# EAGLE schematic RiseUpTop (EAGLE 9.6.1)
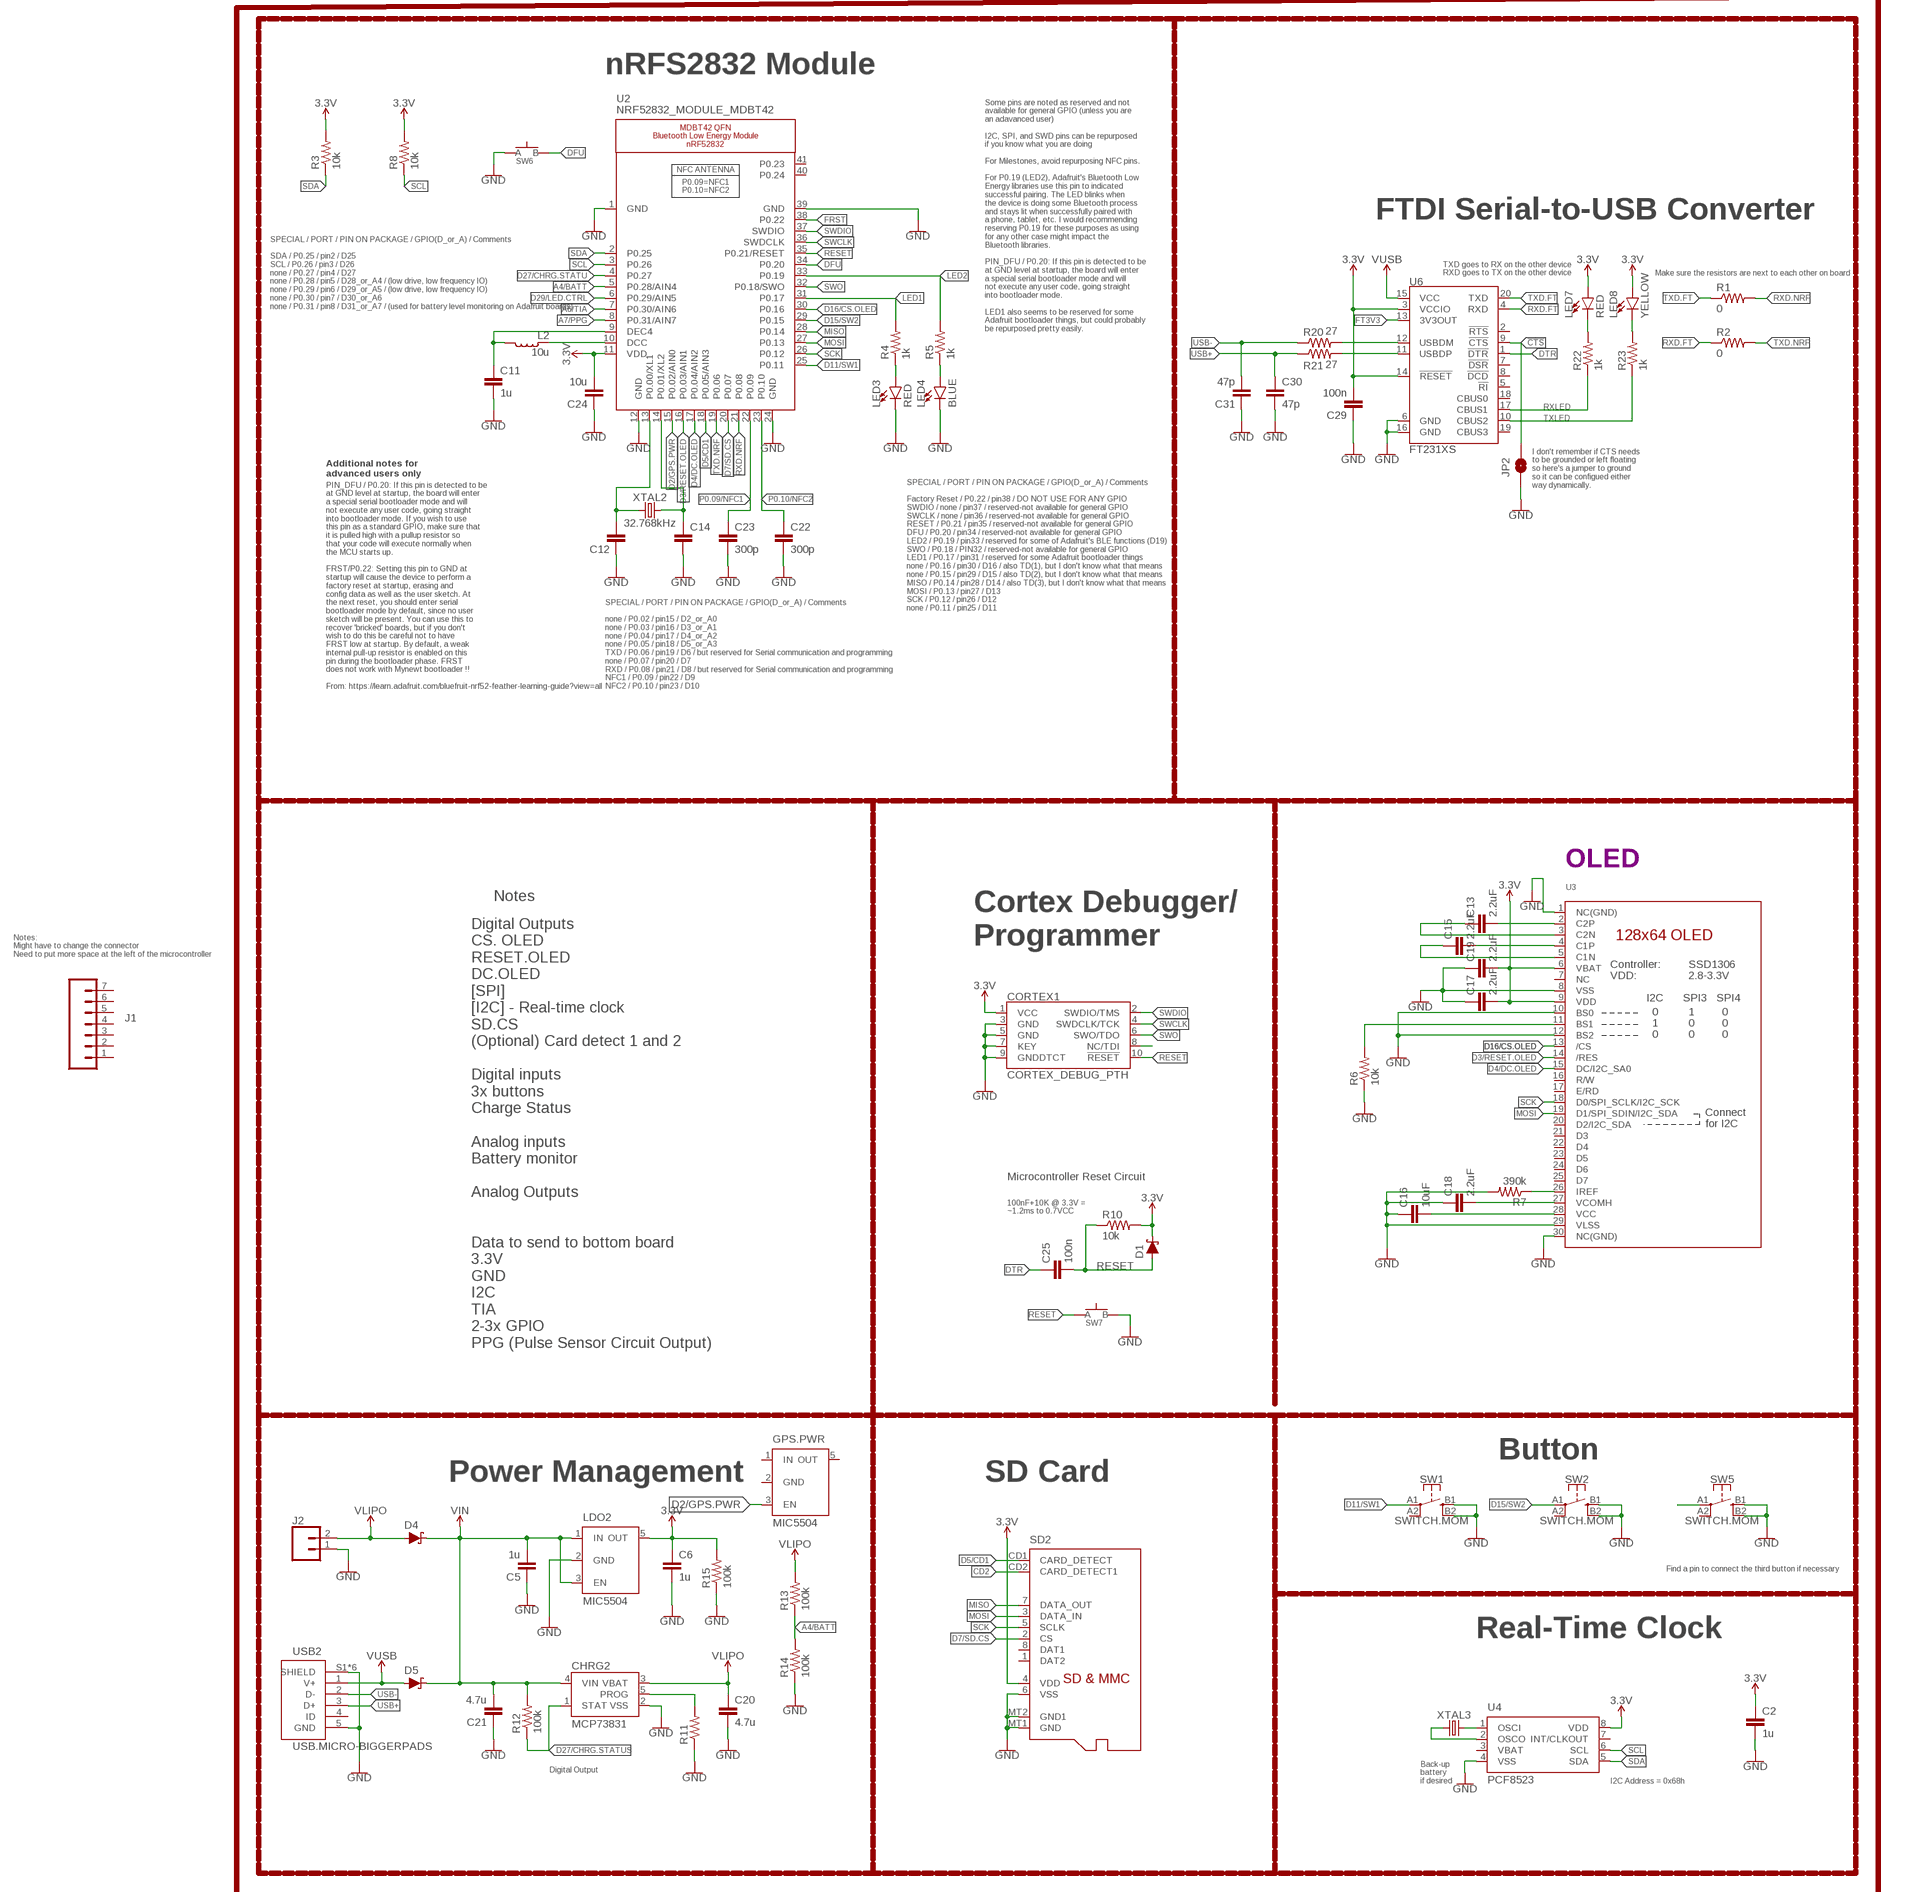
[diagram p0: schematic, sheet 1, part 1 of 2]
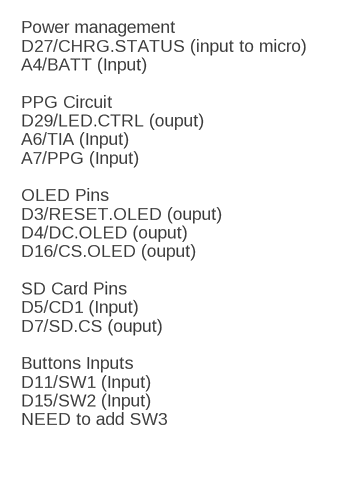
[diagram p1: schematic, sheet 1, part 2 of 2]

## Parts
C2  1u  CAPACITOR0603  [C0603]
C5  1u  CAPACITOR0603  [C0603]
C6  1u  CAPACITOR0603  [C0603]
C11  1u  CAPACITOR0603  [C0603]
C12  CAPACITOR0603  [C0603]
C13  2.2uF  CAPACITOR0402  [C0402]
C14  CAPACITOR0603  [C0603]
C15  2.2uF  CAPACITOR0402  [C0402]
C16  10uF  CAPACITOR0603  [C0603]
C17  2.2uF  CAPACITOR0402  [C0402]
C18  2.2uF  CAPACITOR0402  [C0402]
C19  2.2uF  CAPACITOR0402  [C0402]
C20  4.7u  CAPACITOR0603  [C0603]
C21  4.7u  CAPACITOR0603  [C0603]
C22  300p  CAPACITOR0603  [C0603]
C23  300p  CAPACITOR0603  [C0603]
C24  10u  CAPACITOR0805  [C0805]
C25  100n  CAPACITOR0603  [C0603]
C29  100n  CAPACITOR0603  [C0603]
C30  47p  CAPACITOR0603  [C0603]
C31  47p  CAPACITOR0603  [C0603]
CHRG2  MCP73831  [SOT23-5]
CORTEX1  CORTEX_DEBUG_PTH  [2X5-PTH-1.27MM]
D1  SCHOTTKY-USC  [USC]
D4  SCHOTTKY-USC  [USC]
D5  SCHOTTKY-USC  [USC]
GPS.PWR  MIC5504  [SOT23-5]
J1  CONN_07  [1X07]
J2  CONN_02  [1X02]
JP2  JUMPER-SMT_2_NO_SILK  [SMT-JUMPER_2_NO_SILK]
L2  10u  INDUCTOR0603  [L0603]
LDO2  MIC5504  [SOT23-5]
LED3  RED  LED0603  [LED-0603]
LED4  BLUE  LED0603  [LED-0603]
LED7  RED  LED0603  [LED-0603]
LED8  YELLOW  LED0603  [LED-0603]
R1  0  RESISTOR0603  [R0603]
R2  0  RESISTOR0603  [R0603]
R3  10k  RESISTOR0603  [R0603]
R4  1k  RESISTOR0603  [R0603]
R5  1k  RESISTOR0603  [R0603]
R6  10k  RESISTOR0603  [R0603]
R7  390k  RESISTOR0603  [R0603]
R8  10k  RESISTOR0603  [R0603]
R10  10k  RESISTOR0603  [R0603]
R11  RESISTOR0603  [R0603]
R12  100k  RESISTOR0603  [R0603]
R13  100k  RESISTOR0603  [R0603]
R14  100k  RESISTOR0603  [R0603]
R15  100k  RESISTOR0603  [R0603]
R20  27  RESISTOR0603  [R0603]
R21  27  RESISTOR0603  [R0603]
R22  1k  RESISTOR0603  [R0603]
R23  1k  RESISTOR0603  [R0603]
SD2  MICROSD  [MICROSD]
SW1  SWITCH.MOM  [TACTILE_SWITCH_SMD_6.2MM_TALL]
SW2  SWITCH.MOM  [TACTILE_SWITCH_SMD_6.2MM_TALL]
SW5  SWITCH.MOM  [TACTILE_SWITCH_SMD_6.2MM_TALL]
SW6  SPST-PTS830GG140-COPY.1-3  [BUTTON-GULLWING]
SW7  SPST-PTS830GG140-COPY.1-3  [BUTTON-GULLWING]
U2  NRF52832_MODULE_MDBT42  [BLE_MODULE_RAYTAC_MDBT42]
U3  DISP_OLED_UG-2864HSWEG01-NO-WRAPAROUND  [UG-2864HSWEG01_0.96IN_NO-WRAPAROUND]
U4  PCF8523  [SO8]
U6  FT231XS  [SSOP20_L]
USB2  USB.MICRO-BIGGERPADS  [USB-MICRO-01.BIGGERPADS]
XTAL2  32.768kHz  CRYSTALECS-.327-12.5-12-C-TR  [2-SMD.NOLEAD.2.0MMTO1.2MM]
XTAL3  32.7680kHz  CRYSTALECS-.327-12.5-12-C-TR  [2-SMD.NOLEAD.2.0MMTO1.2MM]

## Nets
3.3V: C2.1 C6.1 C17.2 C19.2 C24.2 C29.2 CORTEX1.1(VCC) D1.-(C) LDO2.5(OUT) LED7.A LED8.A R3.2 R8.2 R10.2 R15.2 SD2.4(VDD) U2.11(VDD) U3.6(VBAT) U3.9(VDD) U4.8(VDD) U6.3(VCCIO) U6.14(!RESET)
!CTS: JP2.2 U6.9(!CTS)
A4/BATT: R13.1 R14.2 U2.5(P0.28/AIN4)
A6/TIA: U2.7(P0.30/AIN6)
A7/PPG: U2.8(P0.31/AIN7)
CD2: SD2.CD2(CARD_DETECT1)
D2/GPS.PWR: GPS.PWR.3(EN) U2.15(P0.02/AIN0)
D3/RESET.OLED: U2.16(P0.03/AIN1) U3.14(/RES)
D4/DC.OLED: U2.17(P0.04/AIN2) U3.15(DC/I2C_SA0)
D5/CD1: SD2.CD1(CARD_DETECT) U2.18(P0.05/AIN3)
D7/SD.CS: SD2.2(CS) U2.20(P0.07)
D11/SW1: SW1.A1 U2.25(P0.11)
D15/SW2: SW2.A1 U2.29(P0.15)
D16/CS.OLED: U2.30(P0.16) U3.13(/CS)
D16/SW3: SW5.A1
D27/CHRG.STATU: U2.4(P0.27)
D27/CHRG.STATUS: CHRG2.1(STAT) R12.1
D29/LED.CTRL: U2.6(P0.29/AIN5)
DFU: SW6.3(B) U2.34(P0.20)
DTR: C25.1 U6.1(!DTR)
FRST: U2.38(P0.22)
FT3V3: U6.13(3V3OUT)
GND: C2.2 C5.1 C6.2 C11.2 C12.1 C14.2 C16.1 C17.1 C18.1 C19.1 C20.2 C21.1 C22.2 C23.2 C24.1 C29.1 C30.2 C31.1 CHRG2.2(VSS) CORTEX1.3(GND) CORTEX1.5(GND) CORTEX1.7(KEY) CORTEX1.9(GNDDTCT) J2.1 JP2.1 LDO2.2(GND) LED3.C LED4.C R6.1 R7.2 R11.1 R14.1 R15.1 SD2.6(VSS) SD2.MT1(GND) SD2.MT2(GND1) SW1.B1 SW1.B2 SW2.B1 SW2.B2 SW5.B1 SW5.B2 SW6.1(A) SW7.3(B) U2.1(GND) U2.12(GND) U2.24(GND) U2.39(GND) U3.1(NC(GND)) U3.8(VSS) U3.10(BS0) U3.12(BS2) U3.29(VLSS) U3.30(NC(GND)) U4.4(VSS) U6.6(GND) U6.16(GND) USB2.5(GND) USB2.S1(SHIELD) USB2.S2(SHIELD) USB2.S3(SHIELD) USB2.S4(SHIELD) USB2.S5(SHIELD) USB2.S6(SHIELD)
LED1: R4.2 U2.31(P0.17)
LED2: R5.2 U2.33(P0.19)
MISO: SD2.7(DATA_OUT) U2.28(P0.14)
MOSI: SD2.3(DATA_IN) U2.27(P0.13) U3.19(D1/SPI_SDIN/I2C_SDA)
N$1: R6.2 U3.11(BS1)
N$2: R7.1 U3.26(IREF)
N$3: C13.2 U3.2(C2P)
N$4: U4.2(OSCO) XTAL3.P$1
N$5: C13.1 U3.3(C2N)
N$6: U4.1(OSCI) XTAL3.P$2
N$7: C15.2 U3.4(C1P)
N$8: C15.1 U3.5(C1N)
N$13: C16.2 U3.28(VCC)
N$15: C18.2 U3.27(VCOMH)
N$16: C12.2 U2.13(P0.00/XL1) XTAL2.P$1
N$17: CHRG2.5(PROG) R11.2
N$18: C14.1 U2.14(P0.01/XL2) XTAL2.P$2
N$21: LED3.A R4.1
N$22: LED4.A R5.1
N$23: L2.1 U2.10(DCC)
N$24: C11.1 L2.2 U2.9(DEC4)
N$25: CORTEX1.8(NC/TDI)
N$30: R20.2 U6.12(USBDM)
N$31: R21.2 U6.11(USBDP)
N$32: LED7.C R22.2
N$33: LED8.C R23.2
P0.09/NFC1: C23.1 U2.22(P0.09)
P0.10/NFC2: C22.1 U2.23(P0.10)
RESET: C25.2 CORTEX1.10(!RESET) D1.+(A) R10.1 SW7.1(A) U2.35(P0.21/RESET)
RXD.FT: R2.1 U6.4(RXD)
RXD.NRF: R1.2 U2.21(P0.08)
RXLED: R22.1 U6.17(CBUS1)
SCK: SD2.5(SCLK) U2.26(P0.12) U3.18(D0/SPI_SCLK/I2C_SCK)
SCL: R8.1 U2.3(P0.26) U4.6(SCL)
SDA: R3.1 U2.2(P0.25) U4.5(SDA)
SWCLK: CORTEX1.4(SWDCLK/TCK) U2.36(SWDCLK)
SWDIO: CORTEX1.2(SWDIO/TMS) U2.37(SWDIO)
SWO: CORTEX1.6(SWO/TDO) U2.32(P0.18/SWO)
TXD.FT: R1.1 U6.20(TXD)
TXD.NRF: R2.2 U2.19(P0.06)
TXLED: R23.1 U6.10(CBUS2)
USB+: C30.1 R21.1 USB2.3(D+)
USB-: C31.2 R20.1 USB2.2(D-)
V_USB: D5.+(A) U6.15(VCC) USB2.1(V+) ; supply symbol labelled VUSB
VIN: C5.2 C21.2 CHRG2.4(VIN) D4.-(C) D5.-(C) LDO2.1(IN) LDO2.3(EN) R12.2
VLIPO: C20.1 CHRG2.3(VBAT) D4.+(A) J2.2 R13.2
Unconnected: GPS.PWR.1(IN) GPS.PWR.2(GND) GPS.PWR.5(OUT) J1.1 J1.2 J1.3 J1.4 J1.5 J1.6 J1.7 SD2.1(DAT2) SD2.8(DAT1) SW1.A2 SW2.A2 SW5.A2 U2.40(P0.24) U2.41(P0.23) U3.7(NC) U3.16(R/W) U3.17(E/RD) U3.20(D2/I2C_SDA) U3.21(D3) U3.22(D4) U3.23(D5) U3.24(D6) U3.25(D7) U4.7(INT/CLKOUT) U6.2(!RTS) U6.5(!RI) U6.7(!DSR) U6.8(!DCD) U6.18(CBUS0) U6.19(CBUS3) USB2.4(ID)

## Notes on the sheet
- nRFS2832 Module
- FTDI Serial-to-USB Converter
- TXD goes to RX on the other device
  RXD goes to TX on the other device
- Make sure the resistors are next to each other on board
- SPECIAL / PORT / PIN ON PACKAGE / GPIO(D_or_A) / Comments
  
  SDA / P0.25 / pin2 / D25
  SCL / P0.26 / pin3 / D26
  none / P0.27 / pin4 / D27
  none / P0.28 / pin5 / D28_or_A4 / (low drive, low frequency IO)
  none / P0.29 / pin6 / D29_or_A5 / (low drive, low frequency IO)
  none / P0.30 / pin7 / D30_or_A6
  none / P0.31 / pin8 / D31_or_A7 / (used for battery level monitoring on Adafruit boards)
- Some pins are noted as reserved and not
  available for general GPIO (unless you are
  an adavanced user)
  
  I2C, SPI, and SWD pins can be repurposed
  if you know what you are doing
  
  For Milestones, avoid repurposing NFC pins.
  
  For P0.19 (LED2), Adafruit's Bluetooth Low
  Energy libraries use this pin to indicated
  successful pairing. The LED blinks when
  the device is doing some Bluetooth process
  and stays lit when successfully paired with
  a phone, tablet, etc. I would recommending
  reserving P0.19 for these purposes as using
  for any other case might impact the
  Bluetooth libraries.
  
  PIN_DFU / P0.20: If this pin is detected to be
  at GND level at startup, the board will enter
  a special serial bootloader mode and will
  not execute any user code, going straight
  into bootloader mode.
  
  LED1 also seems to be reserved for some
  Adafruit bootloader things, but could probably
  be repurposed pretty easily.
- Additional notes for
  advanced users only
- I don't remember if CTS needs
  to be grounded or left floating
  so here's a jumper to ground
  so it can be configued either
  way dynamically.
- SPECIAL / PORT / PIN ON PACKAGE / GPIO(D_or_A) / Comments
  
  Factory Reset / P0.22 / pin38 / DO NOT USE FOR ANY GPIO
  SWDIO / none / pin37 / reserved-not available for general GPIO
  SWCLK / none / pin36 / reserved-not available for general GPIO
  RESET / P0.21 / pin35 / reserved-not available for general GPIO
  DFU / P0.20 / pin34 / reserved-not available for general GPIO
  LED2 / P0.19 / pin33 / reserved for some of Adafruit's BLE functions (D19)
  SWO / P0.18 / PIN32 / reserved-not available for general GPIO
  LED1 / P0.17 / pin31 / reserved for some Adafruit bootloader things
  none / P0.16 / pin30 / D16 / also TD(1), but I don't know what that means
  none / P0.15 / pin29 / D15 / also TD(2), but I don't know what that means
  MISO / P0.14 / pin28 / D14 / also TD(3), but I don't know what that means
  MOSI / P0.13 / pin27 / D13
  SCK / P0.12 / pin26 / D12
  none / P0.11 / pin25 / D11
- PIN_DFU / P0.20: If this pin is detected to be
  at GND level at startup, the board will enter
  a special serial bootloader mode and will
  not execute any user code, going straight
  into bootloader mode. If you wish to use
  this pin as a standard GPIO, make sure that
  it is pulled high with a pullup resistor so
  that your code will execute normally when
  the MCU starts up.
  
  FRST/P0.22: Setting this pin to GND at
  startup will cause the device to perform a
  factory reset at startup, erasing and
  config data as well as the user sketch. At
  the next reset, you should enter serial
  bootloader mode by default, since no user
  sketch will be present. You can use this to
  recover 'bricked' boards, but if you don't
  wish to do this be careful not to have
  FRST low at startup. By default, a weak
  internal pull-up resistor is enabled on this
  pin during the bootloader phase. FRST
  does not work with Mynewt bootloader !!
  
  From: https://learn.adafruit.com/bluefruit-nrf52-feather-learning-guide?view=all
- SPECIAL / PORT / PIN ON PACKAGE / GPIO(D_or_A) / Comments
  
  none / P0.02 / pin15 / D2_or_A0
  none / P0.03 / pin16 / D3_or_A1
  none / P0.04 / pin17 / D4_or_A2
  none / P0.05 / pin18 / D5_or_A3
  TXD / P0.06 / pin19 / D6 / but reserved for Serial communication and programming
  none / P0.07 / pin20 / D7
  RXD / P0.08 / pin21 / D8 / but reserved for Serial communication and programming
  NFC1 / P0.09 / pin22 / D9
  NFC2 / P0.10 / pin23 / D10
- OLED
- Notes
- Cortex Debugger/
  Programmer
- Notes:
  Might have to change the connector
  Need to put more space at the left of the microcontroller
- Microcontroller Reset Circuit
- 100nF+10K @ 3.3V =
  ~1.2ms to 0.7VCC
- Digital Outputs
  CS. OLED
  RESET.OLED
  DC.OLED
  [SPI]
  [I2C] - Real-time clock
  SD.CS
  (Optional) Card detect 1 and 2
  
  Digital inputs 
  3x buttons
  Charge Status
  
  Analog inputs
  Battery monitor
  
  Analog Outputs
  
  
  Data to send to bottom board 
  3.3V
  GND
  I2C
  TIA
  2-3x GPIO
  PPG (Pulse Sensor Circuit Output)
- Button
- Power Management | SD Card
- Power management 
  D27/CHRG.STATUS (input to micro)
  A4/BATT (Input)
  
  PPG Circuit
  D29/LED.CTRL (ouput)
  A6/TIA (Input)
  A7/PPG (Input)
  
  OLED Pins
  D3/RESET.OLED (ouput)
  D4/DC.OLED (ouput)
  D16/CS.OLED (ouput)
  
  SD Card Pins
  D5/CD1 (Input)
  D7/SD.CS (ouput)
  
  Buttons Inputs
  D11/SW1 (Input)
  D15/SW2 (Input)
  NEED to add SW3
- Find a pin to connect the third button if necessary
- Real-Time Clock
- Digital Output
- Back-up
  battery
  if desired
- I2C Address = 0x68h

## Power pins joined to a net without a drawn wire
VBAT: U4.3(VBAT)

## Library data of the parts
C2 C5 C6 C11-C25 C29-C31 = LinnesLab-Passives:CAPACITOR
CHRG2 = LinnesLab-Power:MCP73831: MCP73831T Li-Ion, Li-Pol Controller Miniature single cell, fully integrated Li-Ion, Li-polymer charge management controller Datasheet <http://ww1.microchip.com/downloads/en/DeviceDoc/20001984g.pdf> SparkFun Products: SparkFun ESP32 Thing <https://www.sparkfun.com/products/13907> SparkFun 9DoF Razor IMU M0 <https://www.sparkfun.com/products/14001>; PROD_ID: IC-09995
CORTEX1 = LinnesLab-Connectors:CORTEX_DEBUG: Cortex Debug Connector - 10 pin Supports JTAG debug, Serial Wire debug, and Serial Wire Viewer. PTH and SMD connector options available. General Connector Information <http://infocenter.arm.com/help/topic/com.arm.doc.faqs/attached/13634/cortex_debug_connectors.pdf> Products: PTH Connector <http://www.digikey.com/product-detail/en/cnc-tech/3220-10-0100-00/1175-1627-ND/3883661> -via Digi-Key SparkFun PSoc <https://www.sparkfun.com/products/13229> SparkFun T <https://www.sparkfun.com/products/13810>
D1 D4 D5 = LinnesLab-DiscreteSemi:SCHOTTKY: Schottky diode A Schottky diode is a semiconductor diode which has a low forward voltage drop and a very fast switching action. Example: Digi-Key Part Number: RB161MM-20CT-ND
GPS.PWR LDO2 = LinnesLab-Power:MIC5504: MIC5504 Voltage Regulator Output Voltages: 1.0V to 3.3V Input Voltages: 2.5V to 5.5V Link to Datasheet http://ww1.microchip.com/downloads/en/DeviceDoc/MIC550X.pdf
J1 = LinnesLab-Connectors:CONN_07: Multi connection point. Often used as Generic Header-pin footprint for 0.1 inch spaced/style header connections On any of the 0.1 inch spaced packages, you can populate with these: Break Away Headers - Straight <https://www.sparkfun.com/products/116> (PRT-00116) Break Away Male Headers - Right Angle <https://www.sparkfun.com/products/553> (PRT-00553) Female Headers <https://www.sparkfun.com/products/115> (PRT-00115) Break Away Headers - Machine Pin <https://www.sparkfun.com/products/117> (PRT-00117) Break Away Female Headers - Swiss Machine Pin <https://www.sparkfun.com/products/743> (PRT-00743) For SCREWTERMINALS and SPRING TERMINALS visit here: Screw Terimnals on SparkFun.com <https://www.sparkfun.com/search/results?term=Screw+Terminals> (5mm/3.5mm/2.54mm spacing) This device is also useful as a general connection point to wire up your design to another part of your project. Our various solder wires solder well into these plated through hole pads. Hook-Up Wire - Assortment (Stranded, 22 AWG) <https://www.sparkfun.com/products/11375> (PRT-11375) Hook-Up Wire - Assortment (Solid Core, 22 AWG) <https://www.sparkfun.com/products/11367> (PRT-11367) View the entire wire category on our website here <https://www.sparkfun.com/categories/141> Special notes: Molex polarized connector foot print use with SKU : PRT-08231 with associated crimp pins and housings. 1MM SMD Version SKU: PRT-10208 NOTES ON THE VARIANTS LOCK and LOCK_LONGPADS... This footprint was designed to help hold the alignment of a through-hole component (i.e. 6-pin header) while soldering it into place. You may notice that each hole has been shifted either up or down by 0.005 of an inch from it's more standard position (which is a perfectly straight line). This slight alteration caused the pins (the squares in the middle) to touch the edges of the holes. Because they are alternating, it causes a "brace" to hold the component in place. 0.005 has proven to be the perfect amount of "off-center" position when using our standard breakaway headers. Although looks a little odd when you look at the bare footprint, once you have a header in there, the alteration is very hard to notice. Also,if you push a header all the way into place, it is covered up entirely on the bottom side.
J2 = LinnesLab-Connectors:CONN_02: Multi connection point. Often used as Generic Header-pin footprint for 0.1 inch spaced/style header connections On any of the 0.1 inch spaced packages, you can populate with these: Break Away Headers - Straight <https://www.sparkfun.com/products/116> (PRT-00116) Break Away Male Headers - Right Angle <https://www.sparkfun.com/products/553> (PRT-00553) Female Headers <https://www.sparkfun.com/products/115> (PRT-00115) Break Away Headers - Machine Pin <https://www.sparkfun.com/products/117> (PRT-00117) Break Away Female Headers - Swiss Machine Pin <https://www.sparkfun.com/products/743> (PRT-00743) For SCREWTERMINALS and SPRING TERMINALS visit here: Screw Terimnals on SparkFun.com <https://www.sparkfun.com/search/results?term=Screw+Terminals> (5mm/3.5mm/2.54mm spacing) This device is also useful as a general connection point to wire up your design to another part of your project. Our various solder wires solder well into these plated through hole pads. Hook-Up Wire - Assortment (Stranded, 22 AWG) <https://www.sparkfun.com/products/11375> (PRT-11375) Hook-Up Wire - Assortment (Solid Core, 22 AWG) <https://www.sparkfun.com/products/11367> (PRT-11367) View the entire wire category on our website here <https://www.sparkfun.com/categories/141> Special notes: Molex polarized connector foot print use with: PRT-08233 with associated crimp pins and housings. 2.54_SCREWTERM for use with PRT-10571. 3.5mm Screw Terminal footprints for PRT-08084 5mm Screw Terminal footprints for use with PRT-08432
JP2 = LinnesLab-Switches:JUMPER-SMT_2_NO: Normally open jumper This jumper has two pads in close proximity to each other. Apply solder to close the connection. Round pads are easier to solder for beginners, but are a lot larger. SparkFun Product that uses the round pads: SparkFun EL Sequencer <https://www.sparkfun.com/products/12781>
L2 = LinnesLab-Passives:INDUCTOR
LED3 LED4 LED7 LED8 = LinnesLab-LED:LED: LED (Generic) Standard schematic elements and footprints for 5mm, 3mm, 1206, and 0603 sized LEDs. Generic LEDs with no color specified. LTST-C190KGKT: arrow indicates cathode
R1-R8 R10-R15 R20-R23 = LinnesLab-Passives:RESISTOR
SD2 = LinnesLab-Connectors:MICROSD: Micro-SD / Transflash card holder with SPI pinout For the 3M # 2908-05WB-MG and/or 4UCON #19656 push-push type
SW1 SW2 SW5 = LinnesLab-Switches:SWITCH.MOM: PTS645SM43SMTR92 LFS
SW6 SW7 = LinnesLab-Switches:SPST-PTS830GG140-COPY
U2 = LinnesLab-Microcontrollers:NRF52832_MODULE_MDBT42: MDBT42 - BLE Module (nRF52832 QFN) VDD: 1.7-3.6V
U3 = LinnesLab-Displays:DISP_OLED_UG-2864HSWEG01: UG-2864HSWEG01 OLED display Both 1.3" and 0.96" models share the same FPC tab footprint, only the screen dimensions vary.
U4 = LinnesLab-Clocks:PCF8523; DIGIKEY: 568-5306-1-ND; I2C_ADDRESS: 0x68h; MFN: PCF8523T/1,118; MFN_MANUFACTURER: NXP USA Inc.
U6 = LinnesLab-DigitalIC:FT231X: FTDI FT231X Full Speed USB to Full-handshake UART This USB2.0 Full Speed IC offers a compact bridge to full handshake UART interfaces. The device is a UART, capable of operating up to 3MBaud, with low power consumption (8mA). The FT231X includes the complete FT-X series feature set and enables USB to be added into a system design quickly and easily over a UART interface. Datasheet <http://cdn.sparkfun.com/datasheets/Components/General%20IC/DS_FT231X.pdf>; DIGIKEY: 768-1156-5-ND; MFN: FT231XS-U
USB2 = LinnesLab-Connectors:USB.MICRO: DigiKey PN: 609-4613-1-ND
XTAL2 XTAL3 = LinnesLab-Clocks:CRYSTAL; DIGIKEY: XC2288CT-ND; FREQ: 32.7680KHZ; LOAD_CAP: 12.5pF